# Altium schematic sheet Connectors.SchDoc
size A3; SheetNumber: 3; SheetTotal: 3
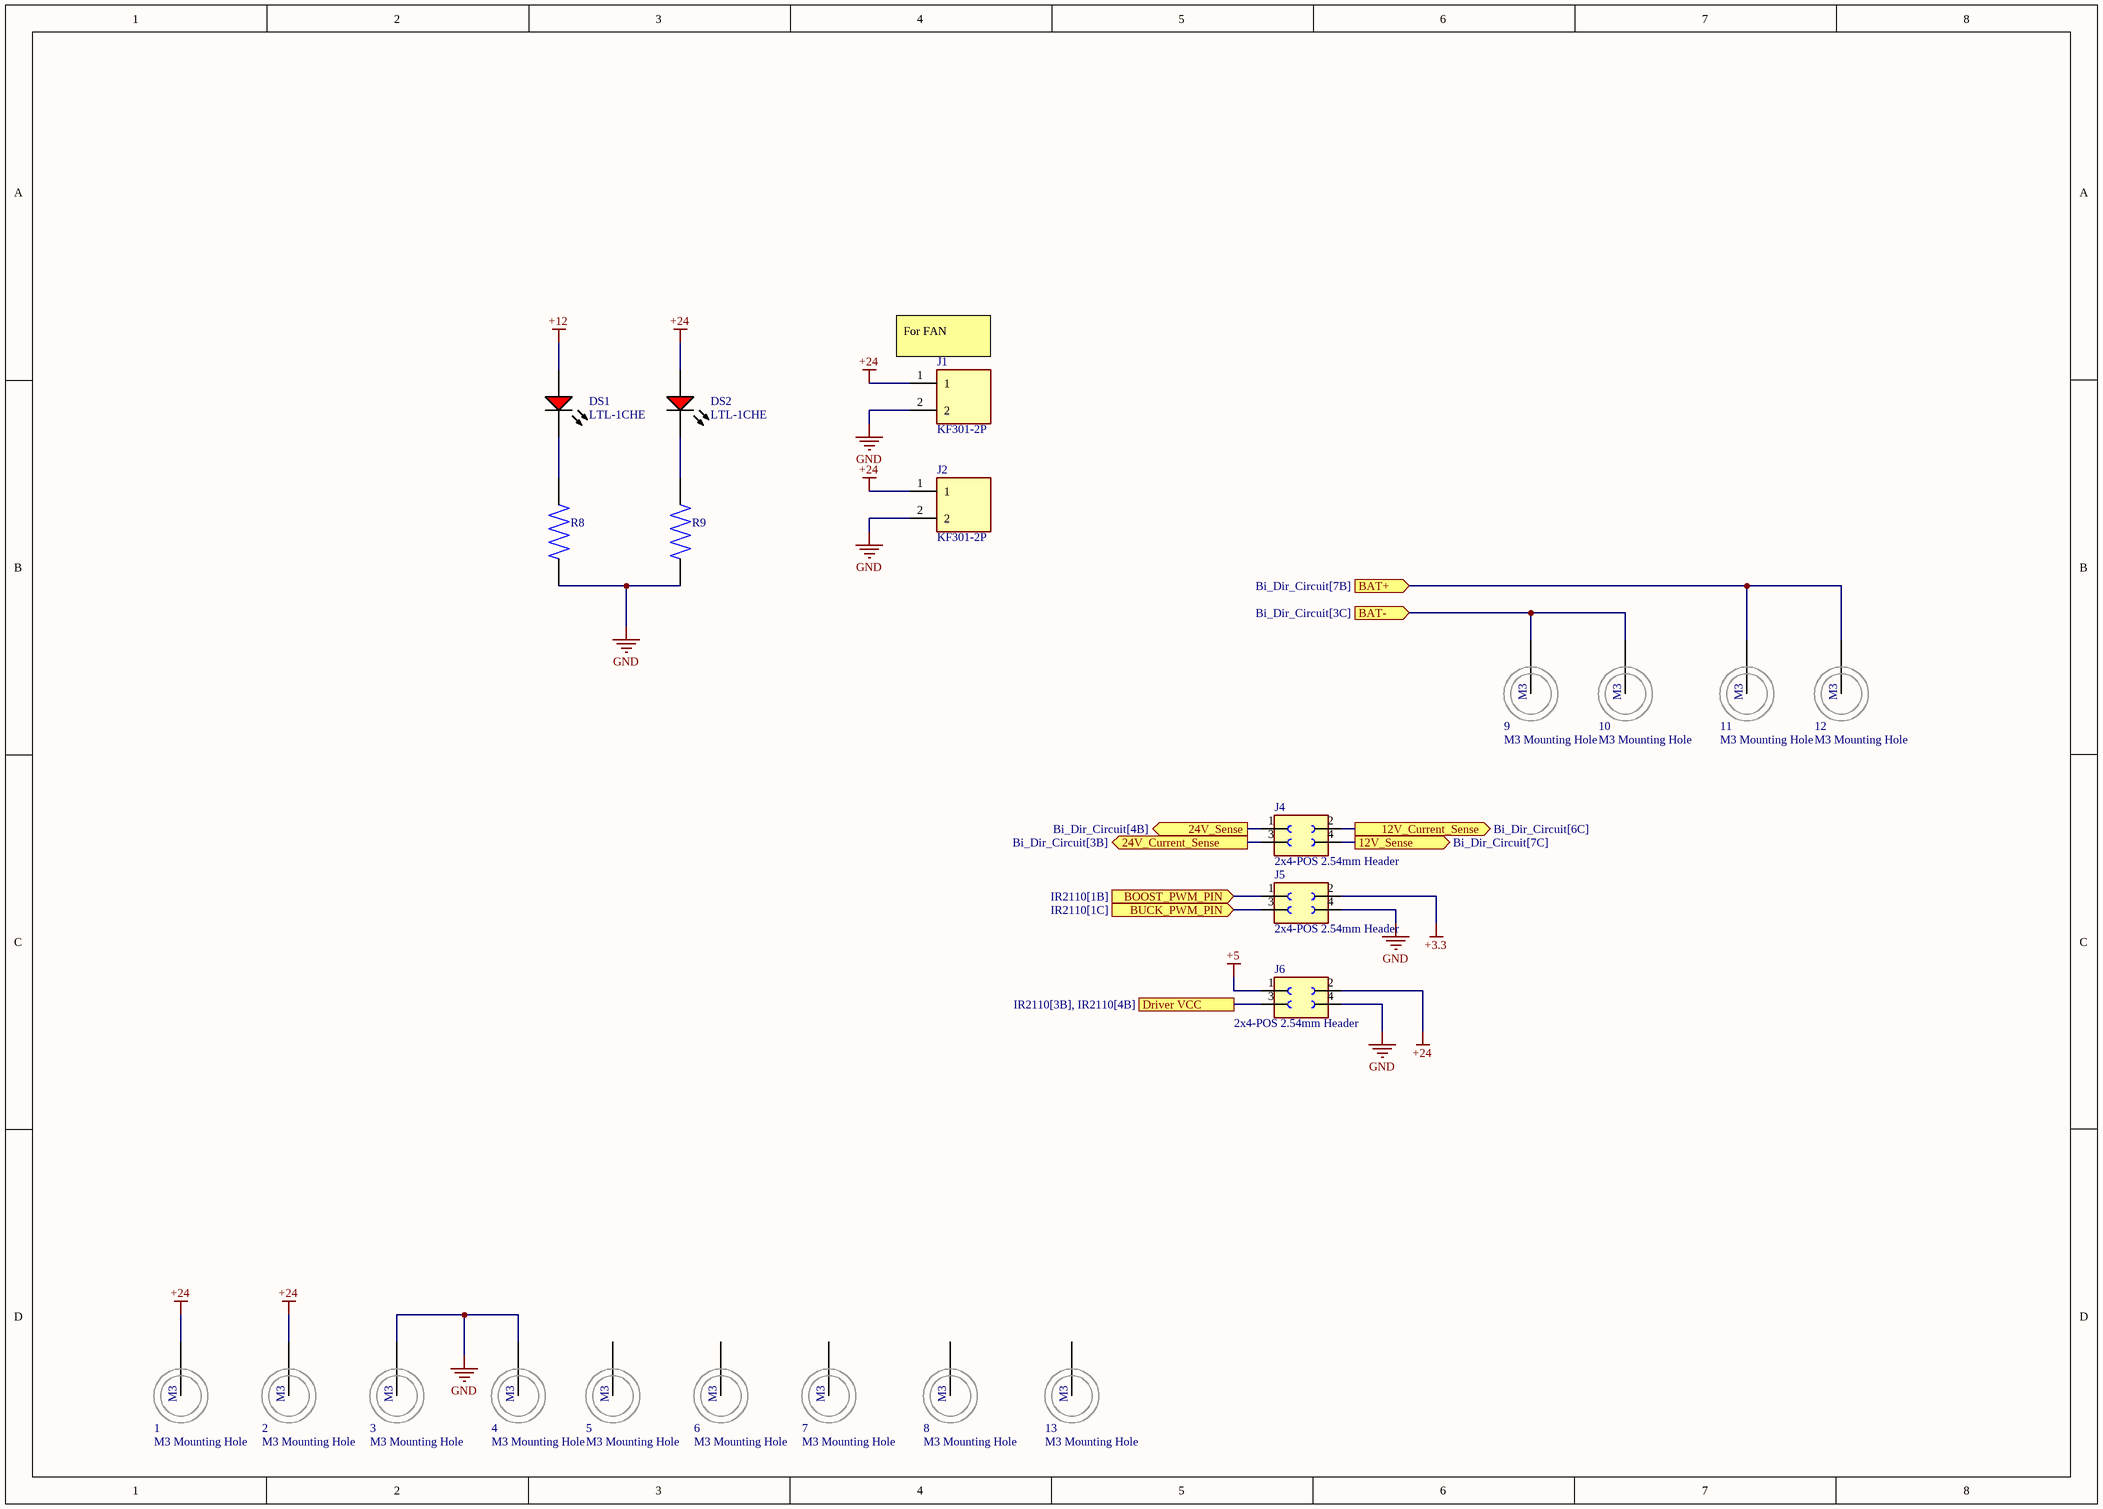
[diagram p0: Connectors.SchDoc]

## Parts
1  M3 Mounting Hole  [M3 - Mounting Hole]
2  M3 Mounting Hole  [M3 - Mounting Hole]
3  M3 Mounting Hole  [M3 - Mounting Hole]
4  M3 Mounting Hole  [M3 - Mounting Hole]
5  M3 Mounting Hole  [M3 - Mounting Hole]
6  M3 Mounting Hole  [M3 - Mounting Hole]
7  M3 Mounting Hole  [M3 - Mounting Hole]
8  M3 Mounting Hole  [M3 - Mounting Hole]
9  M3 Mounting Hole  [M3 - Mounting Hole]
10  M3 Mounting Hole  [M3 - Mounting Hole]
11  M3 Mounting Hole  [M3 - Mounting Hole]
12  M3 Mounting Hole  [M3 - Mounting Hole]
13  M3 Mounting Hole  [M3 - Mounting Hole]
DS1  LTL-1CHE  [LED3mm]
DS2  LTL-1CHE  [LED3mm]
J1  KF301-2P  [KF301-2P]
J2  KF301-2P  [KF301-2P]
J4  2x4-POS 2.54mm Header  [2x4-POS 2.54mm Header]
J5  2x4-POS 2.54mm Header  [2x4-POS 2.54mm Header]
J6  2x4-POS 2.54mm Header  [2x4-POS 2.54mm Header]
R8  Resistor_Through Hole  [Resistor_Through Hole]  (value not drawn)
R9  Resistor_Through Hole  [Resistor_Through Hole]  (value not drawn)

## Ports
12V_Current_Sense (out, see Bi_Dir_Circuit[6C]), 12V_Sense (out, see Bi_Dir_Circuit[7C]), 24V_Current_Sense (out, see Bi_Dir_Circuit[3B]), 24V_Sense (out, see Bi_Dir_Circuit[4B]), BAT+ (in, see Bi_Dir_Circuit[7B]), BAT- (in, see Bi_Dir_Circuit[3C]), BOOST_PWM_PIN (in, see IR2110[1B]), BUCK_PWM_PIN (in, see IR2110[1C]), Driver VCC (see IR2110[3B], IR2110[4B])

## Nets
+3.3: J5.2
+5: J6.1
+12: DS1.1(A)
+24: 1.1(M3) 2.1(M3) DS2.1(A) J1.1 J2.1 J6.2
GND: 3.1(M3) 4.1(M3) J1.2 J2.2 J5.4 J6.4 R8.2 R9.2
12V_Current_Sense: J4.2 ; port 12V_Current_Sense
12V_Sense: J4.4 ; port 12V_Sense
24V_Current_Sense: J4.3 ; port 24V_Current_Sense
24V_Sense: J4.1 ; port 24V_Sense
BAT+: 11.1(M3) 12.1(M3) ; port BAT+
BAT-: 9.1(M3) 10.1(M3) ; port BAT-
BOOST_PWM_PIN: J5.1 ; port BOOST_PWM_PIN
BUCK_PWM_PIN: J5.3 ; port BUCK_PWM_PIN
Driver VCC: J6.3 ; port Driver VCC
NetDS1_2: DS1.2(K) R8.1
NetDS2_2: DS2.2(K) R9.1

Not connected (* = marked no-connect by the designer): 5 1(M3); 6 1(M3); 7 1(M3); 8 1(M3); 13 1(M3)

## Notes on the sheet
- (near J1) For FAN

## Library data of the parts
DS1 DS2 = RED_LED 3mm: Radial LED, 12.6 mcd, 20 mA, 2 V, -55 to 100 degC, 2-Pin THD, RoHS, Bulk; Shielding: Unshielded; Resistance: 0.045 Ohm; Current Rating: 3.6 A; Tolerance: 20%; PackageReference: LTL-1CHE; PackageDescription: 2-Pin Through Hole Device, Dia 3.8 mm, Pitch 2.54 mm; Case\Package: Radial; Length: 0.97 inch; Width: 0.62 inch; Height: 1.1 inch; Radiation Hardening: No; Lead Pitch: 11.44 mm; ComponentLink1URL: http://www.us.liteon.com/; ComponentLink1Description: Manufacturer URL; RoHSCompliant: true; Packaging: Tray; Mount: Through Hole; Min Operating Temperature: -40 degC; Max Operating Temperature: 130 degC; ComponentLink2URL: https://datasheet.ciiva.com/15117/getdatasheetpartid-187746-15117985.pdf; Package Quantity: 55; ComponentLink2Description: Datasheet; DatasheetVersion: Dec-03
J1 J2 = KF301-2P: 2 Pin Terminal Block 5mm Pitch; Price: None; Value: *; MP: KF301-2P; Package: None; Availability: Unavailable
J4-J6 = 2x4-POS 2.54mm Header: Female header [WÃ¼rth Elektronik] 613004243121 Female header; SnapEDA_Link: https://www.snapeda.com/parts/613004243121/W%C3%BCrth%20Elektronik/view-part/1737074/?ref=snap; Check_prices: https://www.snapeda.com/parts/613004243121/W%C3%BCrth%20Elektronik/view-part/1737074/?ref=eda; Availability: Unavailable; Value: *; MF: WÃ¼rth Elektronik; Price: None; MP: 613004243121; Package: None
R8 R9 = Resistor_Through Hole: 1.02 Ohms Â±1% 0.25W, 1/4W Through Hole Resistor Axial Metal Film; MP: MFR-25FTE52-1R; MF: Yageo; Availability: Warning; Value: *; Check_prices: https://www.snapeda.com/parts/MFR-25FTE52-1R/Yageo/view-part/4629919/?ref=eda; Package: Axial Yageo; Price: None; SnapEDA_Link: https://www.snapeda.com/parts/MFR-25FTE52-1R/Yageo/view-part/4629919/?ref=snap; Purchase-URL: https://pricing.snapeda.com/search/part/MFR-25FTE52-1R/?ref=eda